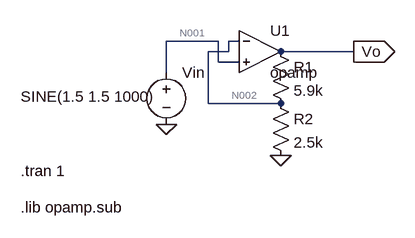
[diagram p0: schematic Booster_0_10.asc]
Booster_0_10.asc, the LTspice schematic file:
Version 4
SHEET 1 880 680
WIRE 96 128 16 128
WIRE 128 128 112 128
WIRE 112 144 112 128
WIRE 112 144 80 144
WIRE 304 144 192 144
WIRE 96 160 96 128
WIRE 128 160 96 160
WIRE 16 176 16 128
WIRE 80 224 80 144
WIRE 192 224 80 224
FLAG 192 304 0
FLAG 304 144 Vo
IOPIN 304 144 Out
FLAG 16 256 0
SYMBOL Opamps\\opamp 160 80 R0
SYMATTR InstName U1
SYMBOL res 176 128 R0
SYMATTR InstName R1
SYMATTR Value 5.9k
SYMBOL res 176 208 R0
SYMATTR InstName R2
SYMATTR Value 2.5k
SYMBOL voltage 16 160 R0
WINDOW 3 -224 53 Left 2
WINDOW 123 0 0 Left 0
WINDOW 39 0 0 Left 0
SYMATTR Value SINE(1.5 1.5 1000)
SYMATTR InstName Vin
TEXT -208 328 Left 2 !.tran 1
TEXT -208 384 Left 2 !.lib opamp.sub

The netlist it stands for:
* Booster_0_10.asc
XU1 N002 N001 Vo opamp Aol=100K GBW=10Meg  ; pins invin noninvin out
R1 Vo N002 5.9k
R2 N002 0 2.5k
Vin N001 0 SINE(1.5 1.5 1000)
.tran 1
.lib opamp.sub
.backanno
.end

* Results of the author's LTspice run, read from the files saved beside the schematic
* Operating Point, zero values left out:
*   V(vo) = 5.04 V
*   V(n001) = 1.5 V
*   V(n002) = 1.5 V
*   I(R2) = 600 µA
*   I(R1) = 600 µA
*   Ix(u1:3) = -600 µA
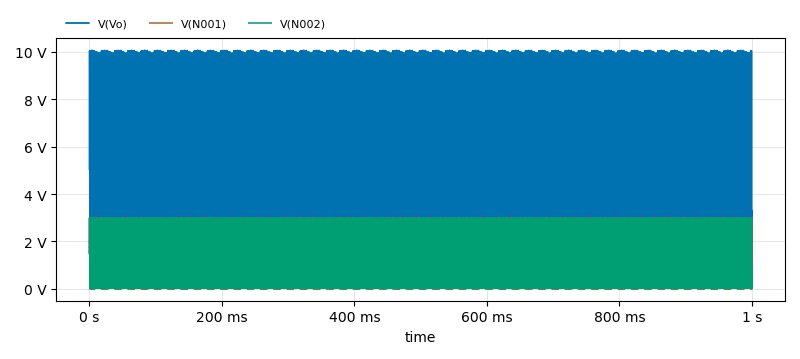
[diagram p1: Transient Analysis of Booster_0_10.asc, plotted from the saved traces]
* Transient Analysis, 1 run:
*   V(Vo): min 10.8 mV, max 10.06 V, average 5.028 V, rms 6.143 V, last 5.038 V
*   V(N001): min 430.8 µV, max 2.999 V, average 1.499 V, rms 1.841 V, last 1.5 V
*   V(N002): min 3.215 mV, max 2.995 V, average 1.496 V, rms 1.828 V, last 1.499 V